# Altium schematic sheet Power.SchDoc
size A4; SheetNumber: 3; SheetTotal: 3
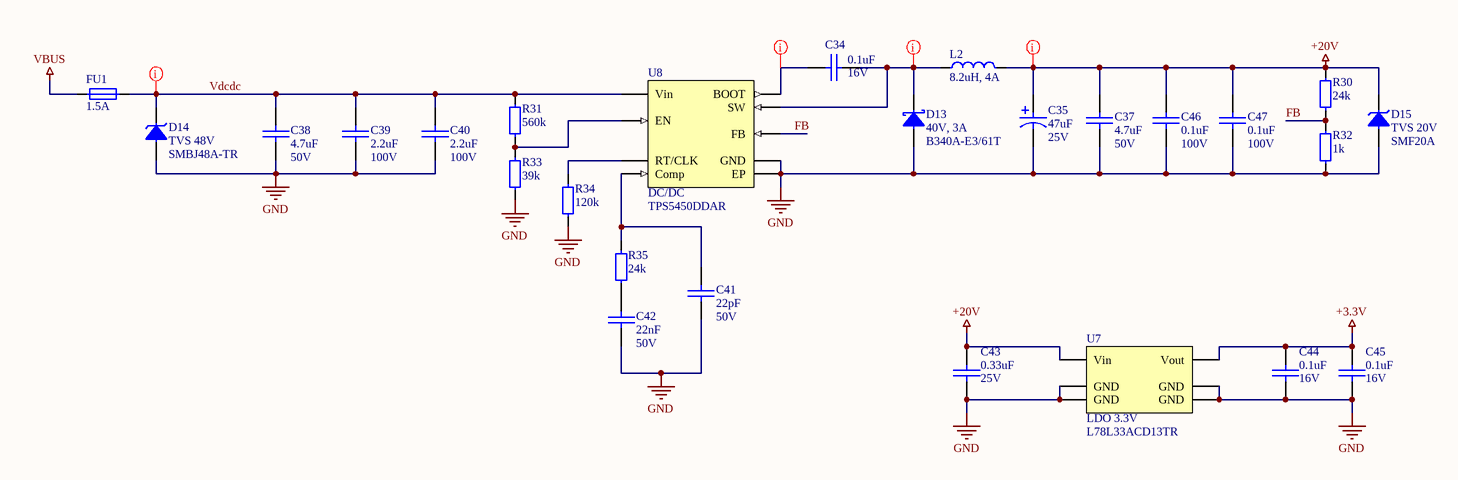
[diagram p0: Power.SchDoc]

## Parts
C34  0.1uF  Voltage: 16V  [0603 Capicator]
C35  47uF  Voltage: 25V  [Bar Cap 6.3x7.7]
C37  4.7uF  Voltage: 50V  [1206 Capacitor]
C38  4.7uF  Voltage: 50V  [1206 Capacitor]
C39  2.2uF  Voltage: 100V  [1206 Capacitor]
C40  2.2uF  Voltage: 100V  [1206 Capacitor]
C41  22pF  Voltage: 50V  [0603 Capicator]
C42  22nF  Voltage: 50V  [0603 Capicator]
C43  0.33uF  Voltage: 25V  [0805 Capicator]
C44  0.1uF  Voltage: 16V  [0603 Capicator]
C45  0.1uF  Voltage: 16V  [0603 Capicator]
C46  0.1uF  Voltage: 100V  [1206 Capacitor]
C47  0.1uF  Voltage: 100V  [1206 Capacitor]
D13  40V, 3A  Part Number: B340A-E3/61T  [SMA]
D14  TVS 48V  Part Number: SMBJ48A-TR  [SMB]
D15  TVS 20V  Part Number: SMF20A  [SOD-123FL]
FU1  1.5A  [1812 Fuse]
L2  8.2uH, 4A  [Inductor 6.9x6.5]
R30  24k  [0603 Resistor]
R31  560k  [0603 Resistor]
R32  1k  [0603 Resistor]
R33  39k  [0603 Resistor]
R34  120k  [0603 Resistor]
R35  24k  [0603 Resistor]
U7  LDO 3.3V  Part Number: L78L33ACD13TR  [SOIC-8]
U8  DC/DC  Part Number: TPS5450DDAR  [HSOP-8]

## Nets
+3.3V: C44.2 C45.2 U7.1(Vout)
+20V: C35.2 C37.2 C43.2 C46.2 C47.2 D15.2 L2.2 R30.2 U7.8(Vin)
GND: C35.1 C37.1 C38.1 C39.1 C40.1 C41.1 C42.1 C43.1 C44.1 C45.1 C46.1 C47.1 D13.1 D14.1 D15.1 R32.1 R33.1 R34.1 U7.2(GND) U7.3(GND) U7.6(GND) U7.7(GND) U8.7(GND) U8.A(EP)
VBUS: FU1.1
FB: R30.1 R32.2 U8.5(FB)
Vdcdc: C38.2 C39.2 C40.2 D14.2 FU1.2 R31.2 U8.2(Vin)
NetC34_1: C34.1 U8.1(BOOT)
NetC34_2: C34.2 D13.2 L2.1 U8.8(SW)
NetC41_2: C41.2 R35.2 U8.6(Comp)
NetC42_2: C42.2 R35.1
NetR31_1: R31.1 R33.2 U8.3(EN)
NetR34_2: R34.2 U8.4(RT/CLK)

## Layout directives
net class DCDC: +20V, NetC34_1, NetC34_2, Vdcdc

## Library data of the parts
C34 C44 C45 = Cap 0.1uF (0603): 0.1uF X7R 16V 10% 0603; Manufacturer: Murata Manufacturing; Part Number: GRM188R71C104KA01D; Type: Capacitor; ComponentLink1Description: Chip&Dip; ComponentLink1URL: https://www.chipdip.ru/product/grm188r71c104ka01d
C35 = Cap Pol 47uF (25V): ECAP SMD,  25V, 105°C, 20%; Part Number: JCK1E470M063054; Manufacturer: JB; Type: Capacitor; ComponentLink1Description: Chip&Dip; ComponentLink1URL: https://www.chipdip.ru/product0/9000565730
C37 C38 = Cap 4.7uF (1206): 4.7uF X7R 10% 50V 1206; Manufacturer: Murata Manufacturing; Part Number: GRM31CR71H475KA12L; Type: Capacitor; ComponentLink1Description: Chip&Dip; ComponentLink1URL: https://www.chipdip.ru/product/grm31cr71h475ka12l
C39 C40 = Cap 2.2uF (1206): 2.2uF X7R 10% 100V 1206; Manufacturer: Murata Manufacturing; Part Number: GRM31CR72A225KA73L; Type: Capacitor; ComponentLink1Description: Chip&Dip; ComponentLink1URL: https://www.chipdip.ru/product0/9000385299
C41 = Cap 22pF (0603): 22pF NP0 50V 5% 0603; Manufacturer: Taiwan; Part Number: MLCC22pFNPO50V5%0603; Type: Capacitor; ComponentLink1Description: Chip&Dip; ComponentLink1URL: https://www.chipdip.ru/product0/472852716
C42 = Cap 22nF (0603): 22nF X7R 50V 10% 0603; Manufacturer: Murata Manufacturing; Part Number: GRM188R71H223KA01D; Type: Capacitor; ComponentLink1Description: Chip&Dip; ComponentLink1URL: https://www.chipdip.ru/product/grm188r71h223k
C43 = Cap 0.33uF (0805): 0.33uF X7R 25V 10% 0805; Manufacturer: Murata Manufacturing; Part Number: GRM21BR71E334KA01L; Type: Capacitor; ComponentLink1Description: Chip&Dip; ComponentLink1URL: https://www.chipdip.ru/product/grm21br71e334k
C46 C47 = Cap 0.1uF (1206): 0.1uF X7R 100V 10% 1206; Manufacturer: Murata Manufacturing; Part Number: GRM319R72A104KA01D; Type: Capacitor; ComponentLink1Description: Chip&Dip; ComponentLink1URL: https://www.chipdip.ru/product0/9000697437
D13 = Diode Schottky (SMA): Diode Schottky 3A 40V; Manufacturer: Vishay; Type: Diode; ComponentLink1Description: DataSheet; ComponentLink1URL: https://static.chipdip.ru/lib/652/DOC001652710.pdf; ComponentLink2Description: Chip&Dip; ComponentLink2URL: https://www.chipdip.ru/product/b340a-e3-61t-2
D14 = TVS Diode 48V [SMBJ]: 600W; Manufacturer: STMicroelectronics; Type: Diode; ComponentLink1Description: DataSheet; ComponentLink1URL: https://static.chipdip.ru/lib/252/DOC011252020.pdf; ComponentLink2Description: Chip&Dip; ComponentLink2URL: https://www.chipdip.ru/product/smbj48a
D15 = TVS Diode 20V [SMF]: 200W; Manufacturer: Yangzhou Yangjie Electronic Technology Co., Ltd.; Type: Diode; ComponentLink1Description: DataSheet; ComponentLink1URL: https://static.chipdip.ru/lib/15https://static.chipdip.ru/lib/152/DOC001152952.pdf2/DOC001152952.pdf; ComponentLink2Description: Chip&Dip; ComponentLink2URL: https://www.chipdip.ru/product/smf20a
FU1 = Fuse Resettable 1.5A: Part Number: MF-MSMF150-2; Manufacturer: Bourns; Type: Fuse; ComponentLink1Description: Chip&Dip; ComponentLink1URL: https://www.chipdip.ru/product0/8009663123; ComponentLink2Description: DataSheet; ComponentLink2URL: https://static.chipdip.ru/lib/167/DOC011167164.pdf
L2 = Inductor 8.2uH (4A): 8.2 uH, 4А, 20%, 6.9х6.5х3mm; Part Number: IHLP2525CZER8R2M01; Manufacturer: Vishay; Type: Inductor; ComponentLink1Description: DataSheet; ComponentLink1URL: https://static.chipdip.ru/lib/957/DOC011957119.pdf; ComponentLink2Description: Chip&Dip; ComponentLink2URL: https://www.chipdip.ru/product0/8698549440; ComponentLink3Description: Electronshik; ComponentLink3URL: https://www.electronshik.ru/item/VISHAY/IHLP2525CZER8R2M01
R30 R35 = Res 24k (0603): 0.1W 0603 24k, 1%; Part Number: RC0603FR-0724KL; Manufacturer: Taiwan; Type: Resistor; ComponentLink1Description: Chip&Dip; ComponentLink1URL: https://www.chipdip.ru/product/0.1w-0603-24-kom-1
R31 = Res 560k (0603): 0.1W 0603 560k, 1%; Part Number: RC0603FR-07560KL; Manufacturer: Taiwan; Type: Resistor; ComponentLink1Description: Chip&Dip; ComponentLink1URL: https://www.chipdip.ru/product0/9000079778
R32 = Res 1k (0603): 0.1W 0603 1k, 1%; Part Number: RC0603FR-071KL; Manufacturer: Taiwan; Type: Resistor; ComponentLink1Description: Chip&Dip; ComponentLink1URL: https://www.chipdip.ru/product0/9000079676
R33 = Res 39k (0603): 0.1W 0603 39k, 1%; Part Number: RC0603FR-0739KL; Manufacturer: Taiwan; Type: Resistor; ComponentLink1Description: Chip&Dip; ComponentLink1URL: https://www.chipdip.ru/product0/9000079750
R34 = Res 120k (0603): 0.1W 0603 120k, 1%; Part Number: RC0603FR-07120KL; Manufacturer: Taiwan; Type: Resistor; ComponentLink1Description: Chip&Dip; ComponentLink1URL: https://www.chipdip.ru/product0/9000079762
U7 = LDO 3.3V [L78]: The L78L series of three-terminal positive regulators employ internal current limiting and thermal shutdown, making them essentially indestructible; Manufacturer: STMicroelectronics; ComponentLink1Description: DataSheet; ComponentLink1URL: https://static.chipdip.ru/lib/837/DOC011837500.pdf; ComponentLink2Description: Chip&Dip; ComponentLink2URL: https://www.chipdip.ru/product/l78l33acd; Type: IC
U8 = DC/DC Controller [TPS5450DDAR]: The TPS5450 is  a  high-output-current PWM converter that integrates a low-resistance, high-side N-channel MOSFET; Manufacturer: Texas Instruments; ComponentLink1Description: Chip&Dip; ComponentLink1URL: https://www.chipdip.ru/product/tps5450ddar-2; ComponentLink2Description: DataSheet; ComponentLink2URL: https://static.chipdip.ru/lib/787/DOC004787015.pdf; Type: IC